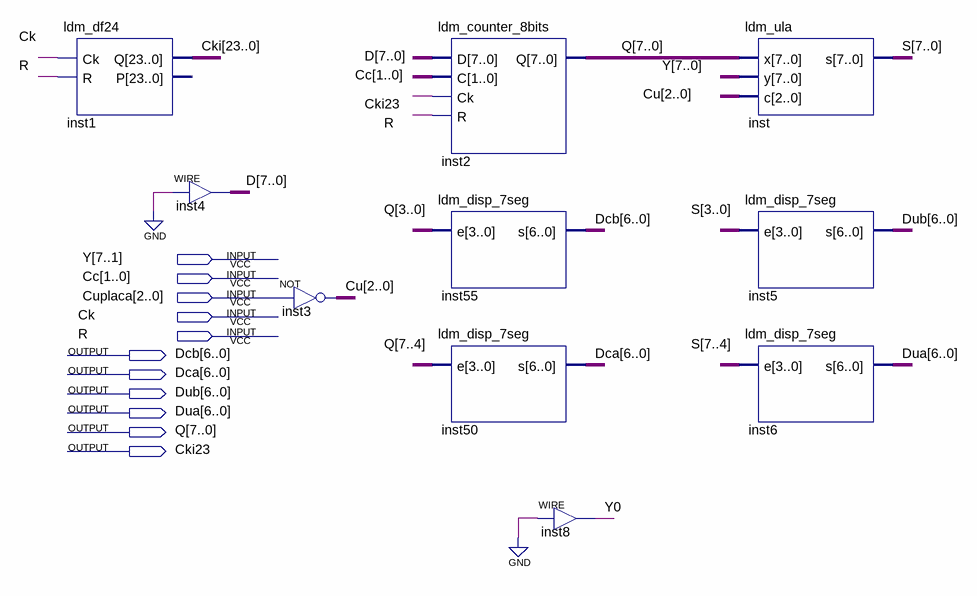
[diagram p0: schematic sheet]
// Quartus schematic ldm_projfinal.bdf as structural Verilog: 10 symbols, 11 pins
module ldm_projfinal (
  input  [7:0] Y,
  input  [1:0] Cc,
  input  [2:0] Cuplaca,
  input  Ck,
  input  R,
  output [6:0] Dcb,
  output [6:0] Dca,
  output [6:0] Dub,
  output [6:0] Dua,
  output [7:0] Q,
  output Cki23
);

  wire [2:0] Cu;
  wire [7:0] D, S;
  wire [22:0] Cki;

  ldm_df24 inst1 (.Ck(Ck), .R(R), .Q({Cki23, Cki}));  // open: P
  assign D = {8{1'b0}};  // WIRE inst4
  assign Cu = ~Cuplaca;  // NOT inst3, 3 bits wide
  ldm_counter_8bits inst2 (.D(D), .C(Cc), .Ck(Cki23), .R(R), .Q(Q));
  ldm_disp_7seg inst55 (.e(Q[3:0]), .s(Dcb));
  ldm_disp_7seg inst50 (.e(Q[7:4]), .s(Dca));
  assign Y[0] = 1'b0;  // WIRE inst8
  ldm_ula inst (.x(Q), .y(Y), .c(Cu), .s(S));
  ldm_disp_7seg inst5 (.e(S[3:0]), .s(Dub));
  ldm_disp_7seg inst6 (.e(S[7:4]), .s(Dua));
endmodule
